# EAGLE schematic door_light (EAGLE 6.4)
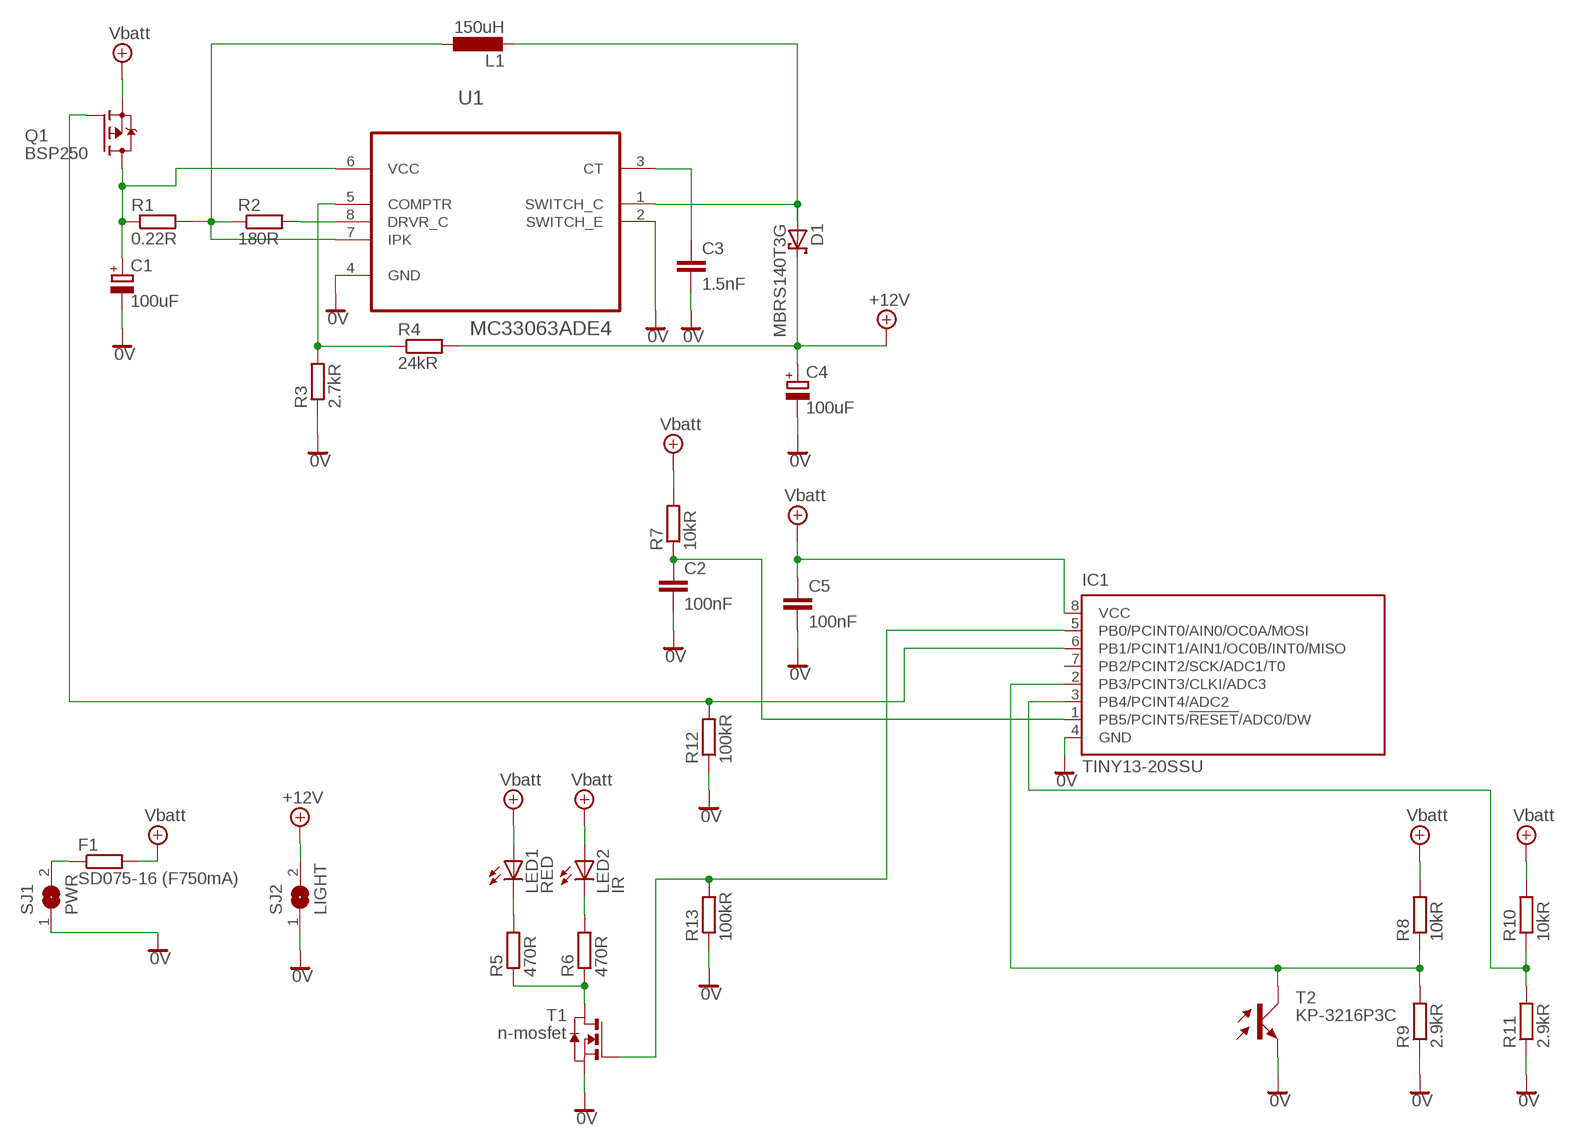
[diagram p0: schematic, sheet 1]

## Parts
C1  100uF  CPOL-EU153CLV-0810  [153CLV-0810]
C2  100nF  C-EUC1206  [C1206]
C3  1.5nF  C-EUC1206  [C1206]
C4  100uF  CPOL-EU153CLV-0810  [153CLV-0810]
C5  100nF  C-EUC1206  [C1206]
D1  MBRS140T3G  MBRS130LT3  [SMB]
F1  SD075-16 (F750mA)  R-EU_MELF0204W  [MINI_MELF-0204W]
IC1  TINY13-20SSU  [8S1]
L1  150uH  L-EUPIS2816  [PIS2816]
LED1  RED  LEDCHIPLED_0603  [CHIPLED_0603]
LED2  IR  LEDCHIPLED_1206  [CHIPLED_1206]
Q1  BSP250  BSP170P  [SOT223]
R1  0.22R  R-EU_M1206  [M1206]
R2  180R  R-EU_R0603  [R0603]
R3  2.7kR  R-EU_R0603  [R0603]
R4  24kR  R-EU_R0603  [R0603]
R5  470R  R-EU_R0603  [R0603]
R6  470R  R-EU_R0603  [R0603]
R7  10kR  R-EU_R0402  [R0402]
R8  10kR  R-EU_R0603  [R0603]
R9  2.9kR  R-EU_R0603  [R0603]
R10  10kR  R-EU_R0603  [R0603]
R11  2.9kR  R-EU_R0603  [R0603]
R12  100kR  R-EU_R0603  [R0603]
R13  100kR  R-EU_R0603  [R0603]
SJ1  PWR  SJW  [SJW]
SJ2  LIGHT  SJW  [SJW]
T1  n-mosfet  NMOSSOT23  [SOT-23]
T2  KP-3216P3C  [OPTO-TRANS-SIEMENS_BP103]
U1  MC33063ADE4  [SOIC127P600X175-8N]

## Nets
0V: C1.- C2.2 C3.2 C4.- C5.2 IC1.4(GND) R3.1 R9.1 R11.1 R12.1 R13.1 SJ1.1 SJ2.1 T1.2(S) T2.EMITER(E) U1.2(SWITCH_E) U1.4(GND)
+4.1V: C5.1 F1.2 IC1.8(VCC) LED1.A LED2.A Q1.3(S) R7.2 R8.2 R10.2 ; supply symbol labelled Vbatt
+12V: C4.+ D1.C R4.2 SJ2.2
N$1: LED1.C R5.2
N$2: LED2.C R6.2
N$3: C1.+ Q1.2(D) Q1.4(D) R1.1 U1.6(VCC)
N$4: R5.1 R6.1 T1.1(D)
N$8: F1.1 SJ1.2
N$9: C2.1 IC1.1(PB5/PCINT5/!RESET!/ADC0/DW) R7.1
N$10: C3.1 U1.3(CT)
N$11: D1.A L1.2 U1.1(SWITCH_C)
N$12: IC1.2(PB3/PCINT3/CLKI/ADC3) R8.1 R9.2 T2.COLLECTOR(C)
N$13: IC1.6(PB1/PCINT1/AIN1/OC0B/INT0/MISO) Q1.1(G) R12.2
N$14: IC1.5(PB0/PCINT0/AIN0/OC0A/MOSI) R13.2 T1.3(G)
N$15: R2.2 U1.8(DRVR_C)
N$16: L1.1 R1.2 R2.1 U1.7(IPK)
N$17: IC1.3(PB4/PCINT4/ADC2) R10.1 R11.2
N$18: R3.2 R4.1 U1.5(COMPTR)
Unconnected: IC1.7(PB2/PCINT2/SCK/ADC1/T0)

## Library data of the parts
C1 C4 = rcl:CPOL-EU: POLARIZED CAPACITOR, European symbol
C2 C3 C5 = rcl:C-EU: CAPACITOR, European symbol
D1 = diode:MBRS130LT3: Schottky Power Rectifier Source: http://www.onsemi.com/pub/Collateral/MBRS130LT3-D.PDF
F1 R1-R13 = rcl:R-EU_: RESISTOR, European symbol
IC1 = atmel:TINY13: 8-bit AVR Microcontroller with 1K Bytes In-System Programmable Flash Source: http://www.atmel.com/dyn/resources/prod_documents/2535S.pdf; MPN: ATTINY13-20SSU; OC_FARNELL: 1455133; OC_NEWARK: 58M3771
L1 = rcl:L-EU: INDUCTOR, European symbol
LED1 LED2 = led:LED: LED OSRAM: - CHIPLED LG R971, LG N971, LY N971, LG Q971, LY Q971, LO R971, LY R971 LH N974, LH R974 LS Q976, LO Q976, LY Q976 LO Q996 - Hyper CHIPLED LW Q18S LB Q993, LB Q99A, LB R99A - SideLED LS A670, LO A670, LY A670, LG A670, LP A670 LB A673, LV A673, LT A673, LW A673 LH A674 LY A675 LS A676, LA A676, LO A676, LY A676, LW A676 LS A679, LY A679, LG A679 - Hyper Micro SIDELED® LS Y876, LA Y876, LO Y876, LY Y876 LT Y87S - SmartLED LW L88C, LW L88S LB L89C, LB L89S, LG L890 LS L89K, LO L89K, LY L89K LS L896, LA L896, LO L896, LY L896 - TOPLED LS T670, LO T670, LY T670, LG T670, LP T670 LSG T670, LSP T670, LSY T670, LOP T670, LYG T670 LG T671, LOG T671, LSG T671 LB T673, LV T673, LT T673, LW T673 LH T674 LS T676, LA T676, LO T676, LY T676, LB T676, LH T676, LSB T676, LW T676 LB T67C, LV T67C, LT T67C, LS T67K, LO T67K, LY T67K, LW E67C LS E67B, LA E67B, LO E67B, LY E67B, LB E67C, LV E67C, LT E67C LW T67C LS T679, LY T679, LG T679 LS T770, LO T770, LY T770, LG T770, LP T770 LB T773, LV T773, LT T773, LW T773 LH T774 LS E675, LA E675, LY E675, LS T675 LS T776, LA T776, LO T776, LY T776, LB T776 LHGB T686 LT T68C, LB T68C - Hyper Mini TOPLED® LB M676 - Mini TOPLED Santana® LG M470 LS M47K, LO M47K, LY M47K Source: http://www.osram.convergy.de LUXEON: - LUMILED® LXK2-PW12-R00, LXK2-PW12-S00, LXK2-PW14-U00, LXK2-PW14-V00 LXK2-PM12-R00, LXK2-PM12-S00, LXK2-PM14-U00 LXK2-PE12-Q00, LXK2-PE12-R00, LXK2-PE12-S00, LXK2-PE14-T00, LXK2-PE14-U00 LXK2-PB12-K00, LXK2-PB12-L00, LXK2-PB12-M00, LXK2-PB14-N00, LXK2-PB14-P00, LXK2-PB14-Q00 LXK2-PR12-L00, LXK2-PR12-M00, LXK2-PR14-Q00, LXK2-PR14-R00 LXK2-PD12-Q00, LXK2-PD12-R00, LXK2-PD12-S00 LXK2-PH12-R00, LXK2-PH12-S00 LXK2-PL12-P00, LXK2-PL12-Q00, LXK2-PL12-R00 Source: www.luxeon.com KINGBRIGHT: KA-3528ASYC Source: www.kingbright.com
Q1 = transistor-fet:BSP170P: SIPMOS(R) Small-Signal-Transistor P-Channel, Enhancement mode Source: http://www.infineon.com/upload/Document/BSP170P_Rev2.4.pdf
SJ1 SJ2 = jumper:SJ: SMD solder JUMPER
T1 = zetex:NMOSSOT23: MOS FET; OC_FARNELL: unknown; OC_NEWARK: unknown
T2 = opto-trans-smd:KP-3216P3C: PHOTO TRANSISTOR KINGBRIGHT ELECTRONIC KP-3216P3C package: 1206 wave length: 940nm max. voltage: 30V view angle: 120° len: transparent; OC_FARNELL: unknown; OC_NEWARK: unknown
U1 = Texas Instruments_By_element14_Batch_1:MC33063ADE4: SWITCHING REGULATORS; MPN: MC33063ADE4; OC_FARNELL: 1053588; OC_NEWARK: 97K4656; PACKAGE: SOIC-8; SUPPLIER: TI